# EAGLE design Adafruit_TMP117 (EAGLE 9.6.2)
COMPANY: ADAFRUIT INDUSTRIES; DRAWN: KTOWN; REV: A
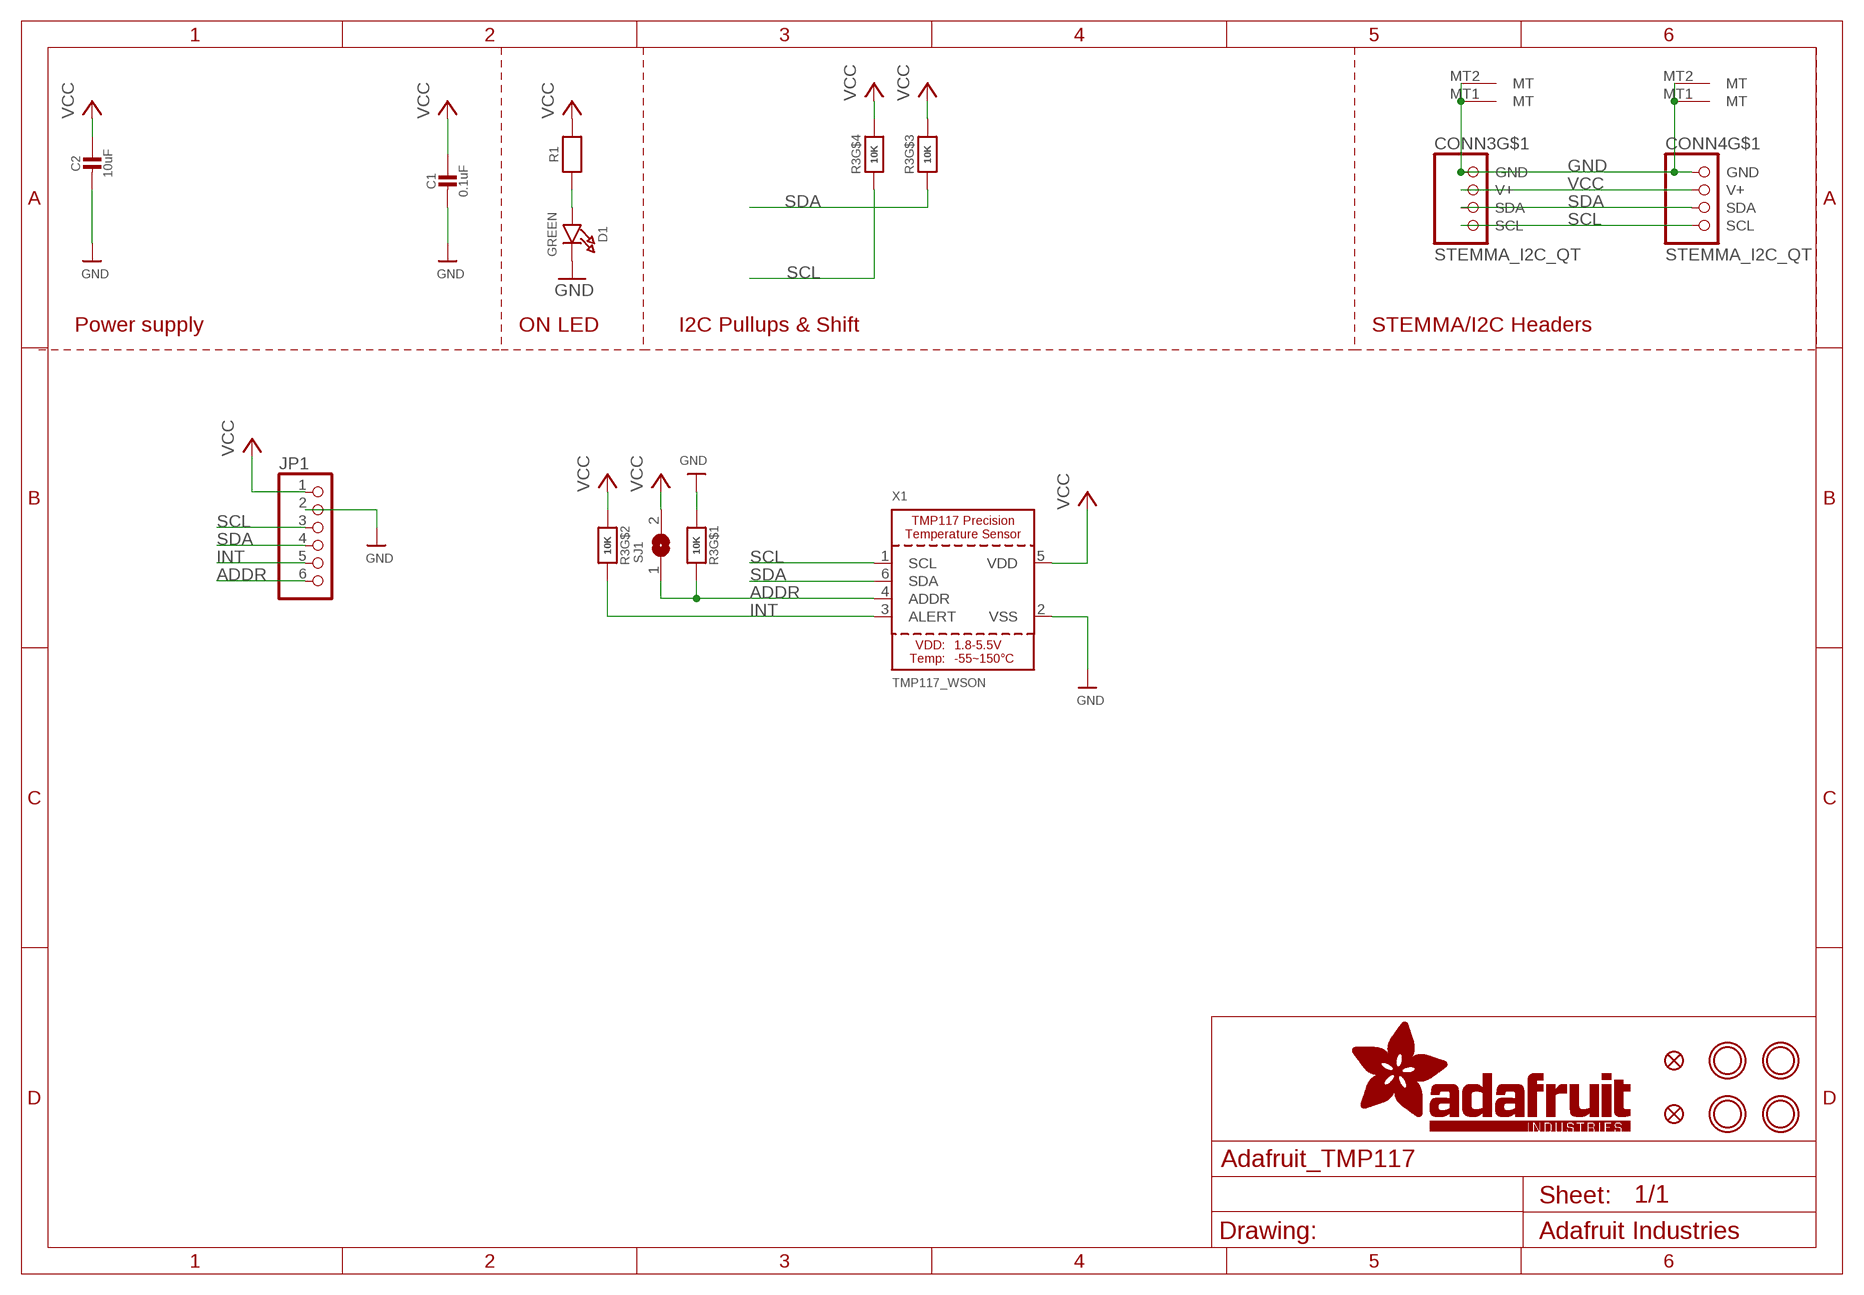
[diagram p0: schematic, sheet 1]

## Parts
C1  0.1uF  CAP_CERAMIC0603_NO  [0603-NO]
C2  10uF  CAP_CERAMIC0805-NOOUTLINE  [0805-NO]
CONN3  STEMMA_I2C_QT  [JST_SH4]
CONN4  STEMMA_I2C_QT  [JST_SH4]
D1  GREEN  LED0603_NOOUTLINE  [CHIPLED_0603_NOOUTLINE]
FID3  FIDUCIAL_1MM  [FIDUCIAL_1MM]
FID4  FIDUCIAL_1MM  [FIDUCIAL_1MM]
JP1  HEADER-1X670MIL  [1X06_ROUND_70]
R1  RESISTOR_0603_NOOUT  [0603-NO]
R3  10K  RESISTOR_4PACK  [RESPACK_4X0603]
SJ1  SOLDERJUMPER  [SOLDERJUMPER_ARROW_NOPASTE]
U$1  MOUNTINGHOLE2.5  [MOUNTINGHOLE_2.5_PLATED]
U$17  MOUNTINGHOLE2.5  [MOUNTINGHOLE_2.5_PLATED]
U$19  MOUNTINGHOLE2.5  [MOUNTINGHOLE_2.5_PLATED]
U$21  MOUNTINGHOLE2.5  [MOUNTINGHOLE_2.5_PLATED]
X1  TMP117_WSON  [WSON-6]

## Nets
ADDR: JP1.6 R3.8 SJ1.1 X1.4(ADDR)
GND [highpower]: C1.2 C2.2 CONN3.1(GND) CONN3.MT1(MT) CONN3.MT2(MT) CONN4.1(GND) CONN4.MT1(MT) CONN4.MT2(MT) D1.C JP1.2 R3.1 X1.2(VSS)
INT: JP1.5 R3.7 X1.3(ALERT)
N$1: D1.A R1.1
SCL: CONN3.4(SCL) CONN4.4(SCL) JP1.3 R3.4 X1.1(SCL)
SDA: CONN3.3(SDA) CONN4.3(SDA) JP1.4 R3.3 X1.6(SDA)
VCC [highpower]: C1.1 C2.1 CONN3.2(V+) CONN4.2(V+) JP1.1 R1.2 R3.2 R3.5 R3.6 SJ1.2 X1.5(VDD)

## Notes on the sheet
- Power supply | ON LED | I2C Pullups & Shift | STEMMA/I2C Headers

## Library data of the parts
C1 C2 = microbuilder:CAP_CERAMIC: Ceramic Capacitors For new designs, use the packages preceded by an '_' character since they are more reliable: The following footprints should be used on most boards: _0402 - Standard footprint for regular board layouts _0603 - Standard footprint for regular board layouts _0805 - Standard footprint for regular board layouts _1206 - Standard footprint for regular board layouts For extremely tight-pitch boards where space is at a premium, the following 'micro-pitch' footprints can be used (smaller pads, no silkscreen outline, etc.): _0402MP - Micro-pitch footprint for very dense/compact boards _0603MP - Micro-pitch footprint for very dense/compact boards _0805MP - Micro-pitch footprint for very dense/compact boards _1206MP - Micro-pitch footprint for very dense/compact boards
CONN3 CONN4 = microbuilder:STEMMA_I2C
D1 = microbuilder:LED: LED 0603 - 0603 Surface Mount Package 2mA: Green LED - Low Power (3.9mcd, 2ma, 1.7Vf) - Digikey: 475-2709-2-ND Orange LED - Low Power (9.8mcd, 2ma, 1.8Vf) - Digikey: 475-1194-2-ND Red LED - Low Power (5mcd, 2ma, 1.8Vf) - Digikey: 475-1195-2-ND Yellow LED - Low Power (7mcd, 2ma, 1.8Vf) - Digikey: 475-1196-2-ND 5mA: Blue LED - Low Power (17mcd, 5ma, 2.9Vf) - Digikey: LNJ937W8CRACT-ND 0805 - 0805 Surface Mount Package 2mA: Red LED (8.8mcd, 2mA, 1.8Vf, Clear) - Low Power [Digikey: 475-2510-1-ND] Green LED (5mcd, 2mA, 1.8Vf, Clear) - Low Power [Digikey: 475-2730-1-ND] Yellow LED (11.3mcd, 2mA, 1.8Vf, Clear) - Low Power [Digikey: 475-2555-1-ND] 20mA: Red LED (104mcd, 20mA, Diffused) - LS R976 [Digikey: 475-1278-6-ND] Red LED (12mcd, 20mA, 2.0Vf, Clear) - APT2012EC [Digikey: 754-1128-1-ND] Green LED (15mcd, 20mA, 2.2Vf, Clear) - APT2012GC [Digikey: 754-1131-1-ND] Orange LED (160mcd, 20mA, 2.1Vf, Clear) - APT2012SECK [Digikey: 754-1130-1-ND] 1206 - 1206 Surface Mount Package Green LED (26mcd, 20mA, Diffused) - LG N971 [Digikey: 475-1407-6-ND] Red LED (15mcd, 20mA, Diffused) - LH N974 [Digikey: 475-1416-6-ND] Cree - Cree High-Power Surface Mount LEDs XPEBWT-L1-0000-00D50 - White 111lm 350mA 2.9Vf 6200K 110° XTEAWT-00-0000-00000LEE3 - White 114lm 350mA 2.85Vf 5000K 115° Everlight - Everlight 45-21 Series Surface Mount LEDs 45-21/QK2C-B2832AC2CB2/2T - Warm White 2000mcd 20mA 3.25Vf 3050K 120° 45-21/LK2C-B38452C4CB2/2T - Nuetral White 2000mcd 20mA 3.25Vf 4150K 120° 45-21/LK2C-B50634C6CB2/2T - Cold White 2200mcd 20mA 3.25Vf 5650K 120° PLCC2 Reverse Mount LS T77K-J1L2-1-0-2-R18-Z - Red 11.25mcd 2mA 1.8Vf 630nm 120° LO T77K-L1M2-24-Z - Orange 19.6mcd 2mA 1.8Vf 606nm 120° LY T77K-K2M1-26-Z - Yellow 15.7mcd 2mA 1.8Vf 587nm 120°
FID3 FID4 = microbuilder:FIDUCIAL: Fiducial Alignment Points Various fiducial points for machine vision alignment.; BOM: EXCLUDE
JP1 = microbuilder:HEADER-1X6: PIN HEADER
R1 = microbuilder:RESISTOR: Resistors For new designs, use the packages preceded by an '_' character since they are more reliable: The following footprints should be used on most boards: _0402 - Standard footprint for regular board layouts _0603 - Standard footprint for regular board layouts _0805 - Standard footprint for regular board layouts _1206 - Standard footprint for regular board layouts For extremely tight-pitch boards where space is at a premium, the following 'micro-pitch' footprints can be used (smaller pads, no silkscreen outline, etc.): _0402MP - Micro-pitch footprint for very dense/compact boards _0603MP - Micro-pitch footprint for very dense/compact boards _0805MP - Micro-pitch footprint for very dense/compact boards _1206MP - Micro-pitch footprint for very dense/compact boards
R3 = microbuilder:RESISTOR_4PACK: Resistor Packs (4 resistors) 4 x 0603 10K 1/16W - Digikey: YC164J-10KCT-ND
SJ1 = microbuilder:SOLDERJUMPER: SMD Solder JUMPER Solder the two pads together to create a connection, or remove the solder to break it. REFLOW - Use this footprint for solder paste and reflow ovens. WAVE - Use this footprint for hand-soldering (larger pads). CLOSED - Has a trace between the two pads to ensure it is closed by default. The trace needs to be cut to disable the jumper, and can be closed again by creating a solder bridge between the two pads.; BOM: EXCLUDE
U$1 U$17 U$19 U$21 = microbuilder:MOUNTINGHOLE: Mounting Hole For #2 screws (0.086"/2.18mm width, 0.094"/2.4mm hole) use 2.5mm; BOM: EXCLUDE
X1 = adafruit_sensor:TMP117

## Net classes
1 highpower: width 0.305 mm, drill 0.483 mm
2 lowpower: width 0.254 mm, drill 0.483 mm

## Board
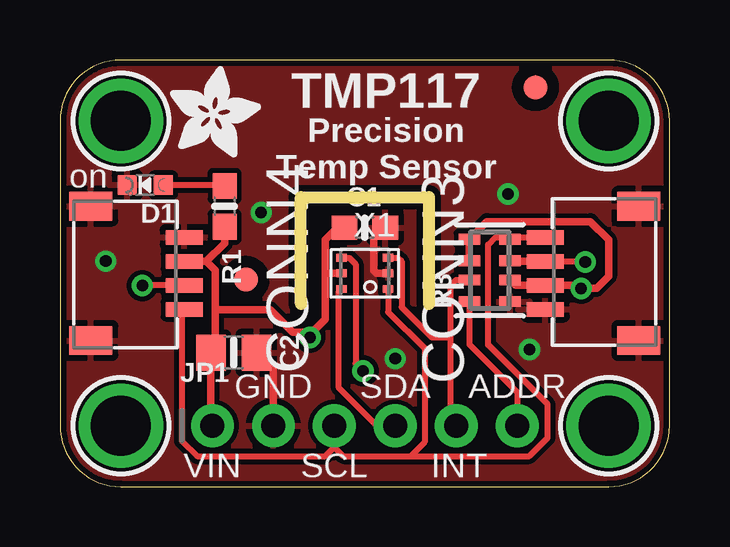
[diagram p1: board, top side]
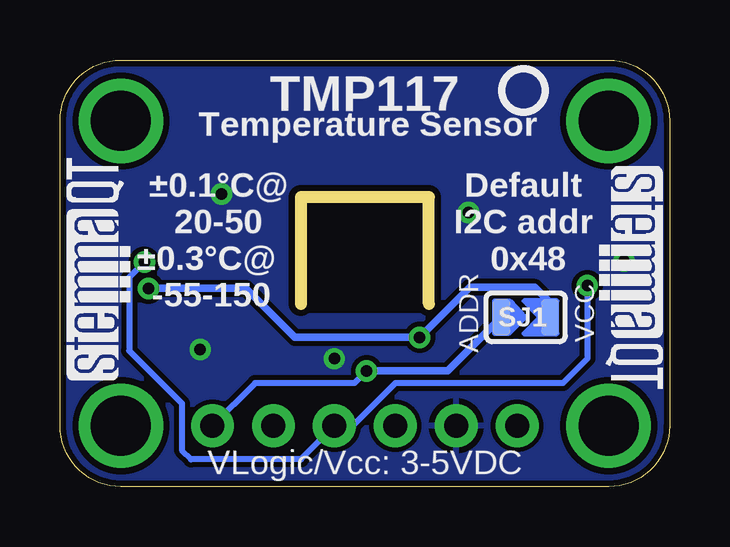
[diagram p2: board, bottom side, seen from below]

Size 25.4 x 17.78 mm. Coordinates in mm from the lower left corner, seen from the top.
Outline: 10.03,7.62 10.03,12.06 15.37,12.06 15.37,7.62
Outline: 0,15.24 0,2.54 arc90 2.54,0 22.86,0 arc90 25.4,2.54 25.4,15.24 arc90 22.86,17.78 2.54,17.78 arc90 0,15.24
Copper layers (1*16): Top 0.035mm / dielectric 1.5mm / Bottom 0.035mm
Design rules "adafruit *": minimum track width 8mil, minimum drill 15.5mil, track to track 8mil, track to pad 8mil, pad to pad 8mil, via to via 8mil, smd to smd 8mil, copper to edge 10mil, drill to drill 8mil, minimum pad ring 10mil, minimum via ring 8mil, stop-mask expansion 2mil, vias tented up to drill 20mil, thermal gap 10mil
bRestrict: area 10.5,7.2 to 14.9,11.3

### Footprints (pad centres in the part's own frame; a part is rotated, then mirrored left to right if it is on the bottom)
0603-NO = smd 1.075 x 1: 1 -0.85,0; 2 0.85,0
0805-NO = smd 1.24 x 1.5: 1 -0.95,0; 2 0.95,0
JST_SH4 = smd 0.6 x 1.55: 1 -1.5,2.514; 2 -0.5,2.514; 3 0.5,2.514; 4 1.5,2.514 | smd 1.2 x 1.8: MT1 -2.8,-1.386; MT2 2.8,-1.386
CHIPLED_0603_NOOUTLINE = smd 0.8 x 0.8: A 0,-0.75; C 0,0.75
FIDUCIAL_1MM = smd 1 x 1: 1 0,0
1X06_ROUND_70 = drill 1 pad 1.778: 1 -6.35,0; 2 -3.81,0; 3 -1.27,0; 4 1.27,0; 5 3.81,0; 6 6.35,0
RESPACK_4X0603 = smd 0.45 x 0.9: 1 -1.3,-0.85; 2 -0.4,-0.85; 3 0.4,-0.85; 4 1.3,-0.85; 5 1.3,0.85; 6 0.4,0.85; 7 -0.4,0.85; 8 -1.3,0.85
SOLDERJUMPER_ARROW_NOPASTE = smd 0.762 x 1.524: 1 -1.016,0; 2 1.016,0
MOUNTINGHOLE_2.5_PLATED = drill 2.5 pad 3.2: P$1 0,0
WSON-6 = smd 0.45 x 0.3: 1 -0.975,0.65; 2 -0.975,0; 3 -0.975,-0.65; 4 0.975,-0.65; 5 0.975,0; 6 0.975,0.65

### Placement (x,y rotation side)
C1  12.7,10.79 0 top
C2  7.24,5.59 0 top
CONN3  22.73,8.89 90 top
CONN4  2.67,8.89 270 top
D1  3.56,12.57 90 top
FID3  7.75,8.64 0 top
FID4  19.81,16.64 0 top
JP1  12.7,2.54 0 top
R1  6.86,11.68 270 top
R3  17.91,9.02 90 top
SJ1  5.99,7.06 0 bottom
U$1  2.54,15.24 0 top
U$17  22.86,15.24 0 top
U$19  2.54,2.54 0 top
U$21  22.86,2.54 0 top
U$22  [ADAFRUIT_3.5MM]  4.57,13.72 0 top
U$25  [PCBFEAT-REV-040]  6.1,16.51 0 bottom
U$30  [STEMMAQT]  22.48,4.45 90 bottom
U$31  [STEMMAQT]  2.92,13.34 270 bottom
X1  12.7,8.89 180 top

### Tracks (layer width: path | path; a pad name or v marks a point on that pad's centre or on a via)
ADDR  (via drill 0.48)
  Top 0.254: X1.4 12.05,9.54 12.32,9.27 12.32,5.13 v12.63,4.83 | R3.8 17.06,5.93 19.05,3.94 JP1.6
  Bottom 0.254: v12.63,4.83 13.13,4.32 17.27,4.32 JP1.6
  Bottom 0.305: v12.63,4.83 9.25,4.83 SJ1.1
GND  (via drill 0.48)
  Top 0.305: JP1.2 8.89,4.89 C2.2 | X1.2 13.21,8.89 13.08,9.02 13.08,10.33 C1.2
  other vias: 1.91,9.4 18.67,12.19 8.38,11.43 13.97,5.33 19.56,5.71
  pour Top: 0,17.78 25.4,17.78 25.4,0 0,0
  pour Bottom: 0,17.78 25.4,17.78 25.4,0 0,0
INT
  Top 0.254: X1.3 14.08,9.54 14.23,9.39 14.23,7.49 15.49,6.22 16.26,6.22 | 16.26,6.22 16.26,8.38 16.49,8.62 R3.7 | 16.26,6.22 16.26,2.79 JP1.5
N$1
  Top 0.254: D1.A 6.82,12.57 R1.1
SCL
  Top 0.254: X1.1 13.68,7.28 15.19,5.77 15.19,1.85 14.61,1.27 | 14.61,1.27 11.81,1.27 11.43,1.65 | 11.43,1.65 JP1.3 | CONN3.4 18.76,10.39 18.14,10.39 17.84,10.09 17.84,5.91 20.32,3.43 20.32,2.03 19.56,1.27 14.61,1.27 | CONN4.4 5.08,7.29 5.08,1.91 5.71,1.27 11.05,1.27 11.43,1.65
  Top 0.305: R3.4 18.76,10.39
SDA  (via drill 0.48)
  Top 0.254: X1.6 11.6,8.11 11.6,4.15 13.21,2.54 JP1.4 | v21.88,9.36 21.85,9.39 CONN3.3 | CONN4.3 v3.44,8.39 v3.43,8.38
  Top 0.305: CONN3.3 18.78,9.39 R3.3
  Bottom 0.254: v21.88,9.36 22.52,8.72 22.52,5.67 20.32,3.48 20.32,1.52 19.94,1.14 15.37,1.14 JP1.4 13.21,2.54 11.43,4.32 4.45,4.32 3.43,5.33 v3.43,8.38
VCC  (via drill 0.48)
  Top 0.305: JP1.1 6.29,2.6 C2.1 6.29,5.79 6.48,5.98 6.48,7.37 | X1.5 11.05,8.89 | 11.05,8.89 11.05,10.29 11.56,10.79 C1.1 | 11.05,8.89 11.05,6.99 10.5,6.44 10.29,6.44 | 10.29,6.44 10.41,6.31 v10.41,6.22 | R3.2 18.98,8.39 CONN3.2 21.59,8.39 v21.72,8.27 22.36,8.27 22.86,8.76 22.86,10.29 22.1,11.05 17.79,11.05 R3.5 R3.6 | CONN4.2 6.1,9.39 | 6.1,9.39 6.48,9.02 6.48,7.37 | 6.48,7.37 8.76,7.37 9.69,6.44 10.29,6.44 | R1.2 6.86,10.14 6.1,9.39
  Bottom 0.305: v21.72,8.27 17.65,8.27 15.61,6.22 v10.41,6.22 8.33,8.31 5.61,8.31 4.98,7.67 SJ1.2

### Text on the board
tPlace: TMP117 | Precision / Temp Sensor | on | GND | SDA | ADDR | VIN | SCL | INT
bPlace: TMP117 | Temperature Sensor | ±0.1°C@ / 20-50 | Default / I2C addr / 0x48 | ±0.3°C@ / -55-150 | VCC | ADDR | VLogic/Vcc: 3-5VDC